# Altium project KIT_ESP32.PrjPcb
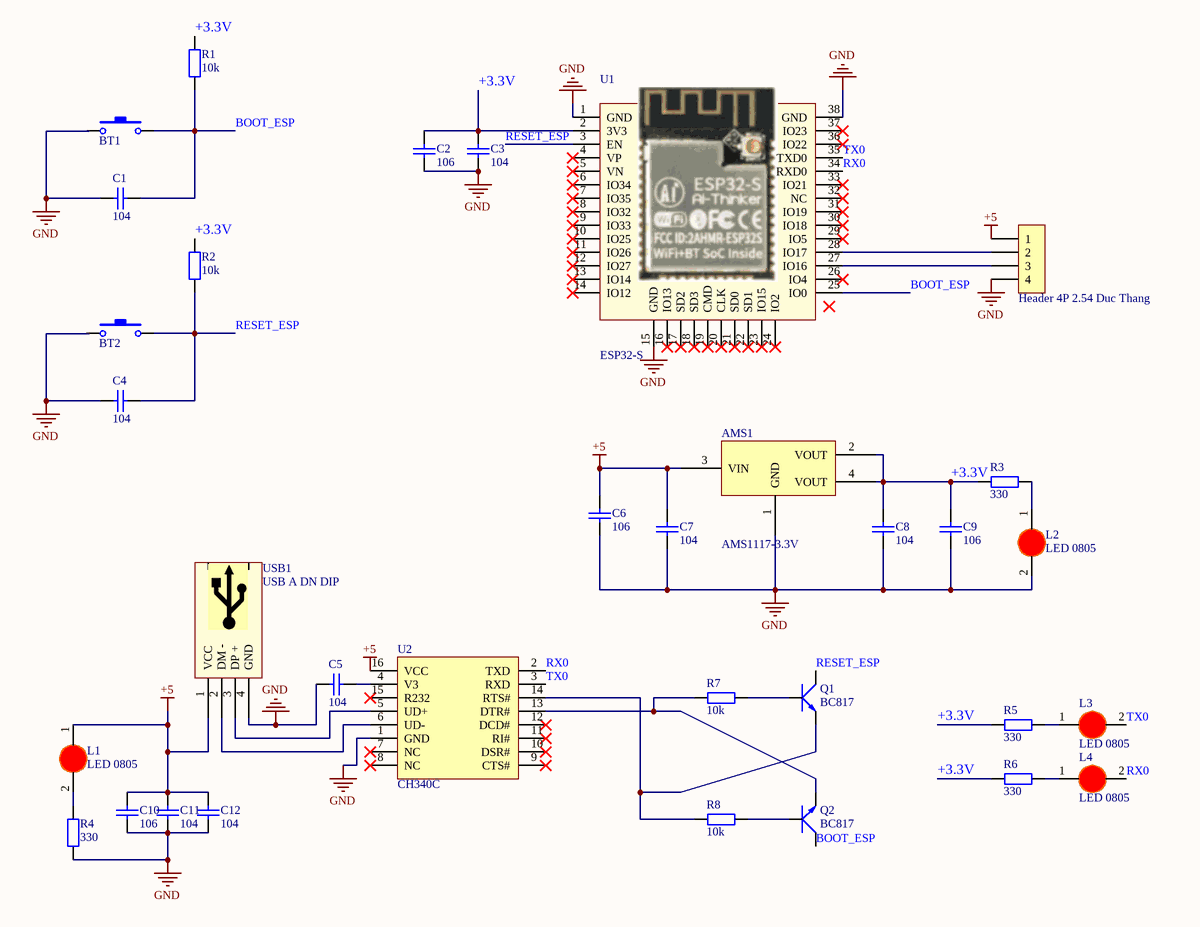
[diagram p0: Sheet9.SchDoc]
1 sheet, 33 parts. Net scope: global (net labels, ports and power ports of the same name join across sheets).
Board file: PCB5.PcbDoc

## Sheet Sheet9.SchDoc
size A3; SheetNumber: 1; SheetTotal: 1

### Parts
AMS1  AMS1117-3.3V  [SOT223]
BT1  Nut Nhan 2 Chan SMD 3x6x2.5  [Nut Nhan 2 Chan SMD 3x6x2.5]  (value not drawn)
BT2  Nut Nhan 2 Chan SMD 3x6x2.5  [Nut Nhan 2 Chan SMD 3x6x2.5]  (value not drawn)
C1  104  [tu 0805]
C2  106  [tu 0805]
C3  104  [tu 0805]
C4  104  [tu 0805]
C5  104  [tu 0805]
C6  106  [tu 0805]
C7  104  [tu 0805]
C8  104  [tu 0805]
C9  106  [tu 0805]
C10  106  [tu 0805]
C11  104  [tu 0805]
C12  104  [tu 0805]
H1  Header 4P 2.54 Duc Thang  [XH2.54M-4]
L1  LED 0805  [LED-0805-Red]
L2  LED 0805  [LED-0805-Red]
L3  LED 0805  [LED-0805-Red]
L4  LED 0805  [LED-0805-Red]
Q1  BC817  [SOT-23]
Q2  BC817  [SOT-23]
R1  10k  [Tro SMD 0805]
R2  10k  [Tro SMD 0805]
R3  330  [tro smd 0805]
R4  330  [tro smd 0805]
R5  330  [tro smd 0805]
R6  330  [tro smd 0805]
R7  10k  [tro smd 0805]
R8  10k  [tro smd 0805]
U1  ESP32-S  [ESP-32WR]
U2  CH340C  [SOIC16_50_284_25X90_SMT]
USB1  USB A DN DIP  [USB A DN DIP]

### Nets
+5: AMS1.3(VIN) C6.2 C7.2 C10.2 C11.2 C12.2 H1.1 L1.1(A) U2.16(VCC) USB1.1(VCC)
GND: AMS1.1(GND) BT1.1 BT2.1 C1.1 C2.1 C3.1 C4.1 C5.1 C6.1 C7.1 C8.2 C9.2 C10.1 C11.1 C12.1 H1.4 L2.2(K) R4.2 U1.1(GND) U1.15(GND) U1.38(GND) U2.1(GND) USB1.4(GND)
+3.3V: AMS1.2(VOUT) AMS1.4(VOUT) C2.2 C3.2 C8.1 C9.1 R1.2 R2.2 R3.2 R5.2 R6.2 U1.2(3V3)
BOOT_ESP: BT1.2 C1.2 Q2.3(C) R1.1 U1.25(IO0)
RESET_ESP: BT2.2 C4.2 Q1.3(C) R2.1 U1.3(EN)
RX0: L4.2(K) U1.34(RXD0) U2.2(TXD)
TX0: L3.2(K) U1.35(TXD0) U2.3(RXD)
NetC5_2: C5.2 U2.4(V3)
NetH1_2: H1.2 U1.28(IO17)
NetH1_3: H1.3 U1.27(IO16)
NetL1_2: L1.2(K) R4.1
NetL2_1: L2.1(A) R3.1
NetL3_1: L3.1(A) R5.1
NetL4_1: L4.1(A) R6.1
NetQ1_1: Q1.1(B) R7.1
NetQ1_2: Q1.2(E) R8.2 U2.14(RTS#)
NetQ2_1: Q2.1(B) R8.1
NetQ2_2: Q2.2(E) R7.2 U2.13(DTR#)
NetU2_5: U2.5(UD+) USB1.3(DP_+)
NetU2_6: U2.6(UD-) USB1.2(DM_-)

Not connected (* = marked no-connect by the designer): U1 4(VP)* 5(VN)* 6(IO34)* 7(IO35)* 8(IO32)* 9(IO33)* 10(IO25)* 11(IO26)* 12(IO27)* 13(IO14)* 14(IO12)* 16(IO13)* 17(SD2)* 18(SD3)* 19(CMD)* 20(CLK)* 21(SD0)* 22(SD1)* 23(IO15)* 24(IO2)* 26(IO4)* 29(IO5)* 30(IO18)* 31(IO19)* 32(NC)* 33(IO21)* 36(IO22)* 37(IO23)*; U2 7(NC)* 8(NC)* 9(CTS#)* 10(DSR#)* 11(RI#)* 12(DCD#)* 15(R232)*; USB1 5 6

### Library data of the parts
AMS1 = AMS1117 SMD: Dán; Value: AMS1117-3.3V SOT223; Don_Vi: Con; Ma_Hang: MH000596; Ghi_Chu: *; Kieu_Chan: *; Chung_Loai: Dán
BT1 BT2 = Nut Nhan 2 Chan SMD 3x6x2.5: Ma_Hang: MH001036; Ten: Nút Nhấn 2 Chân 3x6x2.5MM SMD
C1-C12 = Tu 0805 104 50V 10%: Dán; Don_Vi: Con; So_Chan: 2; Ten_Linh_Kien: Tụ 0805 104-100nF 10% 50V; Ma_Hang: MH004551; Chung_Loai: Dán; Kieu_Chan: *
H1 = Header 4P 2.54 Duc Thang: Cắm; Ten_Linh_Kien: Header 4P XH2.54-4P Đực Thẳng; Don_Vi: Con; Ma_Hang: MH001285; Chung_Loai: Cắm
L1-L4 = LED 0805 Do: Dán; Don_Vi: Con; Ma_Hang: MH000897; Ten_Linh_Kien: LED 0805 Màu Đỏ (Red); Ghi_Chu: *; Kieu_Chan: *; Chung_Loai: Dán
Q1 Q2 = Trans BC817: SOT-23 - C8658; Value: C9014
R1 R2 = Tro 0805 5% 82k: Dán; Don_Vi: Con; So_Chan: 2; Ten_Linh_Kien: Trở 0805 5% 82k; Ma_Hang: MH005329; Chung_Loai: Dán; Kieu_Chan: *
R3-R8 = Tro 0805 1% 10k: Dán; Don_Vi: Con; So_Chan: 2; Ten_Linh_Kien: Trở 0805 1% 10k; Ma_Hang: MH005473; Chung_Loai: Dán; Kieu_Chan: *
U2 = CH340C: USB Bridge, USB to UART USB 2.0 UART Interface; Manufacturer: Olimex; Alternate Part Number-1: NA; Manufacturer Part Number: CH340C; Case/Package: SOIC16; Supplier-1: LCSC; Supplier Part Number-1: C84681
USB1 = USB A DN DIP: USB Type A; Ten: USB A Đực DIP; Ma_Hang: MH000940